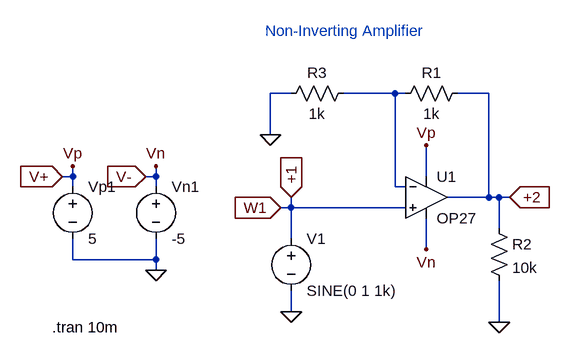
[diagram p0: schematic noninv_amp.asc]
noninv_amp.asc, the LTspice schematic file:
Version 4
SHEET 1 880 680
WIRE 0 48 -32 48
WIRE 160 48 80 48
WIRE 176 48 160 48
WIRE 304 48 256 48
WIRE -32 112 -32 48
WIRE -336 176 -336 160
WIRE -336 176 -352 176
WIRE -208 176 -208 160
WIRE -208 176 -224 176
WIRE 208 176 208 128
WIRE -336 192 -336 176
WIRE -208 192 -208 176
WIRE 160 192 160 48
WIRE 176 192 160 192
WIRE 304 208 304 48
WIRE 304 208 240 208
WIRE 320 208 304 208
WIRE 336 208 320 208
WIRE 0 224 0 208
WIRE 0 224 -16 224
WIRE 176 224 0 224
WIRE 320 256 320 208
WIRE 0 272 0 224
WIRE 208 288 208 240
WIRE -336 304 -336 272
WIRE -208 304 -208 272
WIRE -208 304 -336 304
WIRE -208 320 -208 304
WIRE 0 384 0 352
WIRE 320 400 320 336
FLAG 0 384 0
FLAG 208 288 Vn
FLAG 208 128 Vp
FLAG 320 400 0
FLAG -32 112 0
FLAG -16 224 W1
IOPIN -16 224 In
FLAG 0 208 +1
IOPIN 0 208 In
FLAG 336 208 +2
IOPIN 336 208 In
FLAG -208 320 0
FLAG -336 160 Vp
FLAG -208 160 Vn
FLAG -352 176 V+
IOPIN -352 176 In
FLAG -224 176 V-
IOPIN -224 176 In
SYMBOL voltage 0 256 R0
WINDOW 123 0 0 Left 0
WINDOW 39 0 0 Left 0
SYMATTR InstName V1
SYMATTR Value SINE(0 1 1k)
SYMBOL res 272 32 R90
WINDOW 0 0 56 VBottom 2
WINDOW 3 32 56 VTop 2
SYMATTR InstName R1
SYMATTR Value 1k
SYMBOL res 304 240 R0
SYMATTR InstName R2
SYMATTR Value 10k
SYMBOL res 96 32 R90
WINDOW 0 0 56 VBottom 2
WINDOW 3 32 56 VTop 2
SYMATTR InstName R3
SYMATTR Value 1k
SYMBOL Opamps\\OP27 208 144 R0
SYMATTR InstName U1
SYMBOL voltage -336 176 R0
WINDOW 123 0 0 Left 0
WINDOW 39 0 0 Left 0
SYMATTR InstName Vp1
SYMATTR Value 5
SYMBOL voltage -208 176 R0
WINDOW 123 0 0 Left 0
WINDOW 39 0 0 Left 0
SYMATTR InstName Vn1
SYMATTR Value -5
TEXT -40 -48 Left 2 ;Non-Inverting Amplifier
TEXT -368 408 Left 2 !.tran 10m

The netlist it stands for:
* noninv_amp.asc
V1 +1 0 SINE(0 1 1k)
R1 +2 N001 1k
R2 +2 0 10k
R3 N001 0 1k
XU1 +1 N001 V+ V- +2 OP27  ; pins In+ In- V+ V- OUT
Vp1 V+ 0 5
Vn1 V- 0 -5
* Non-Inverting Amplifier
.tran 10m
.lib ADI.lib
.backanno
.end